# Altium schematic sheet 11 MSM8916_POWER2.SchDoc
size 871 x 579 mm
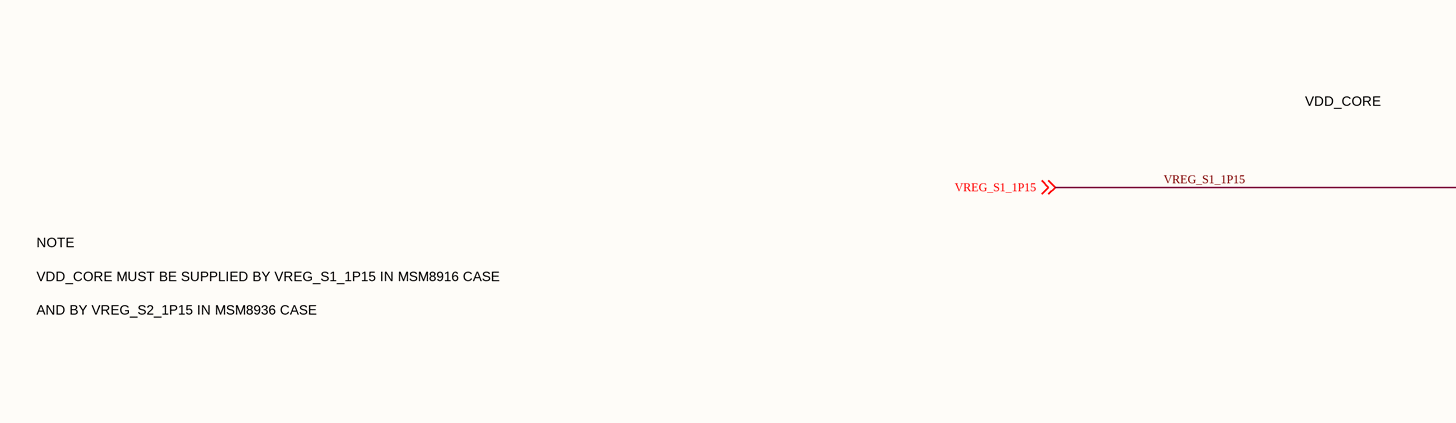
[diagram p0: 11 MSM8916_POWER2.SchDoc, top left]
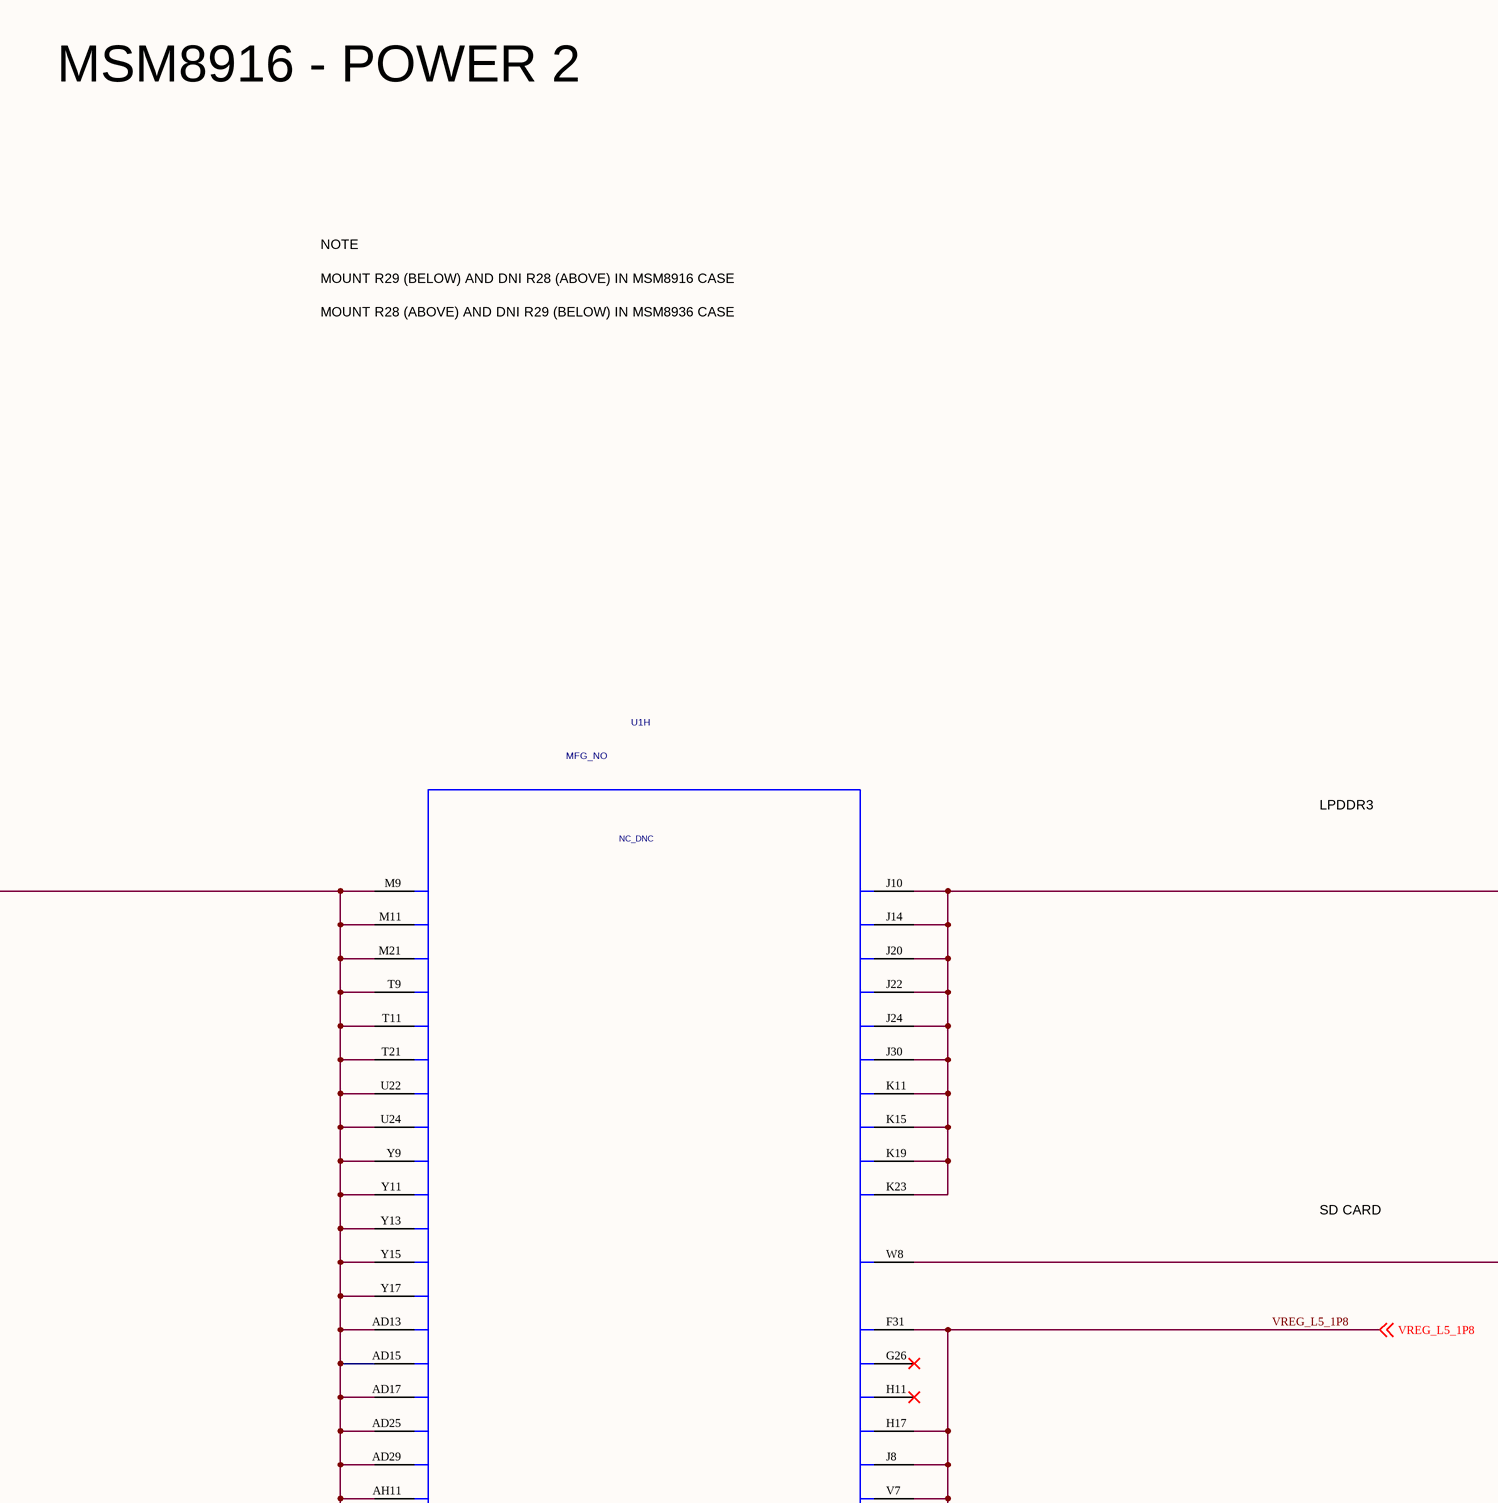
[diagram p1: 11 MSM8916_POWER2.SchDoc, top middle]
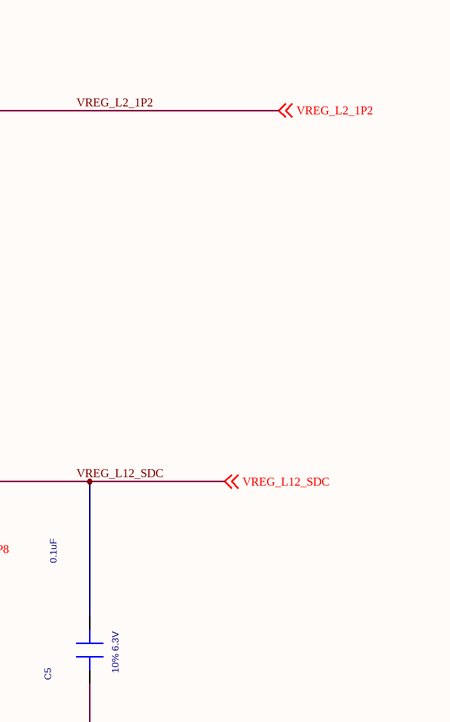
[diagram p2: 11 MSM8916_POWER2.SchDoc, top right]
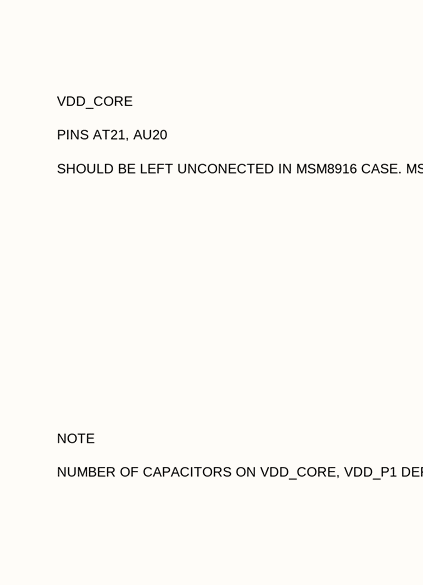
[diagram p3: 11 MSM8916_POWER2.SchDoc, bottom left]
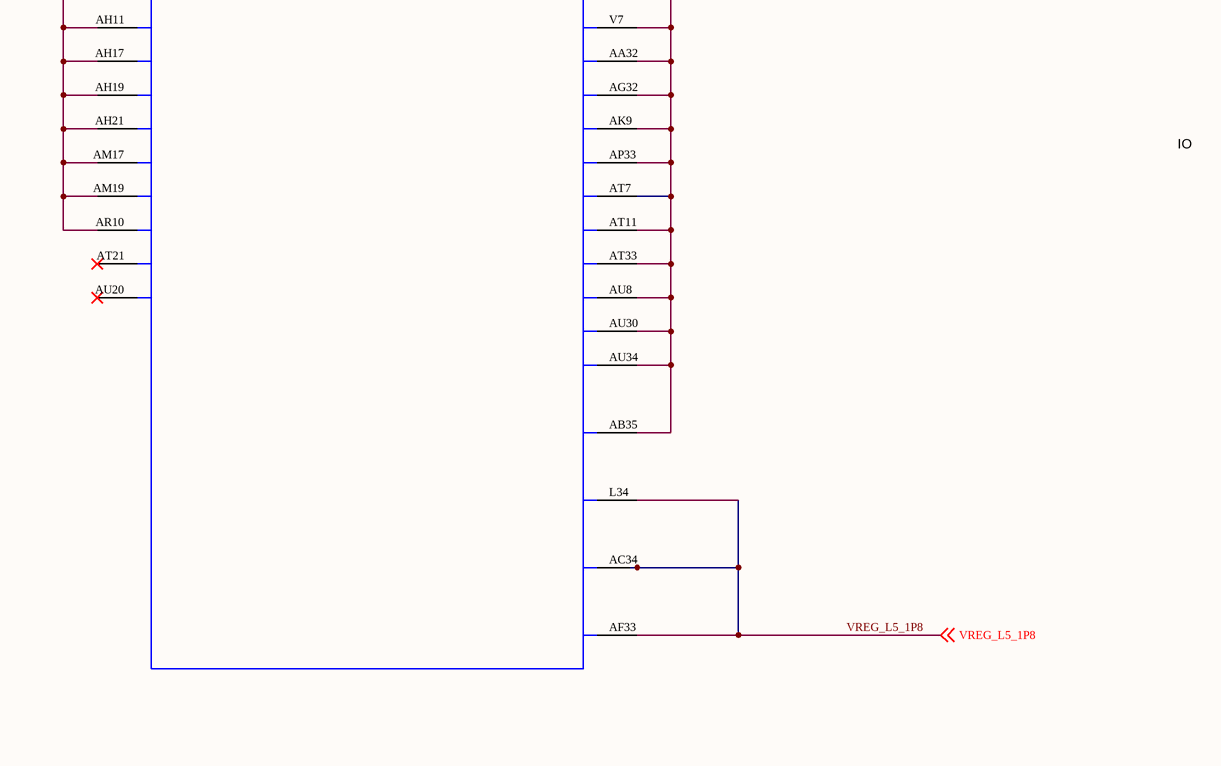
[diagram p4: 11 MSM8916_POWER2.SchDoc, bottom middle]
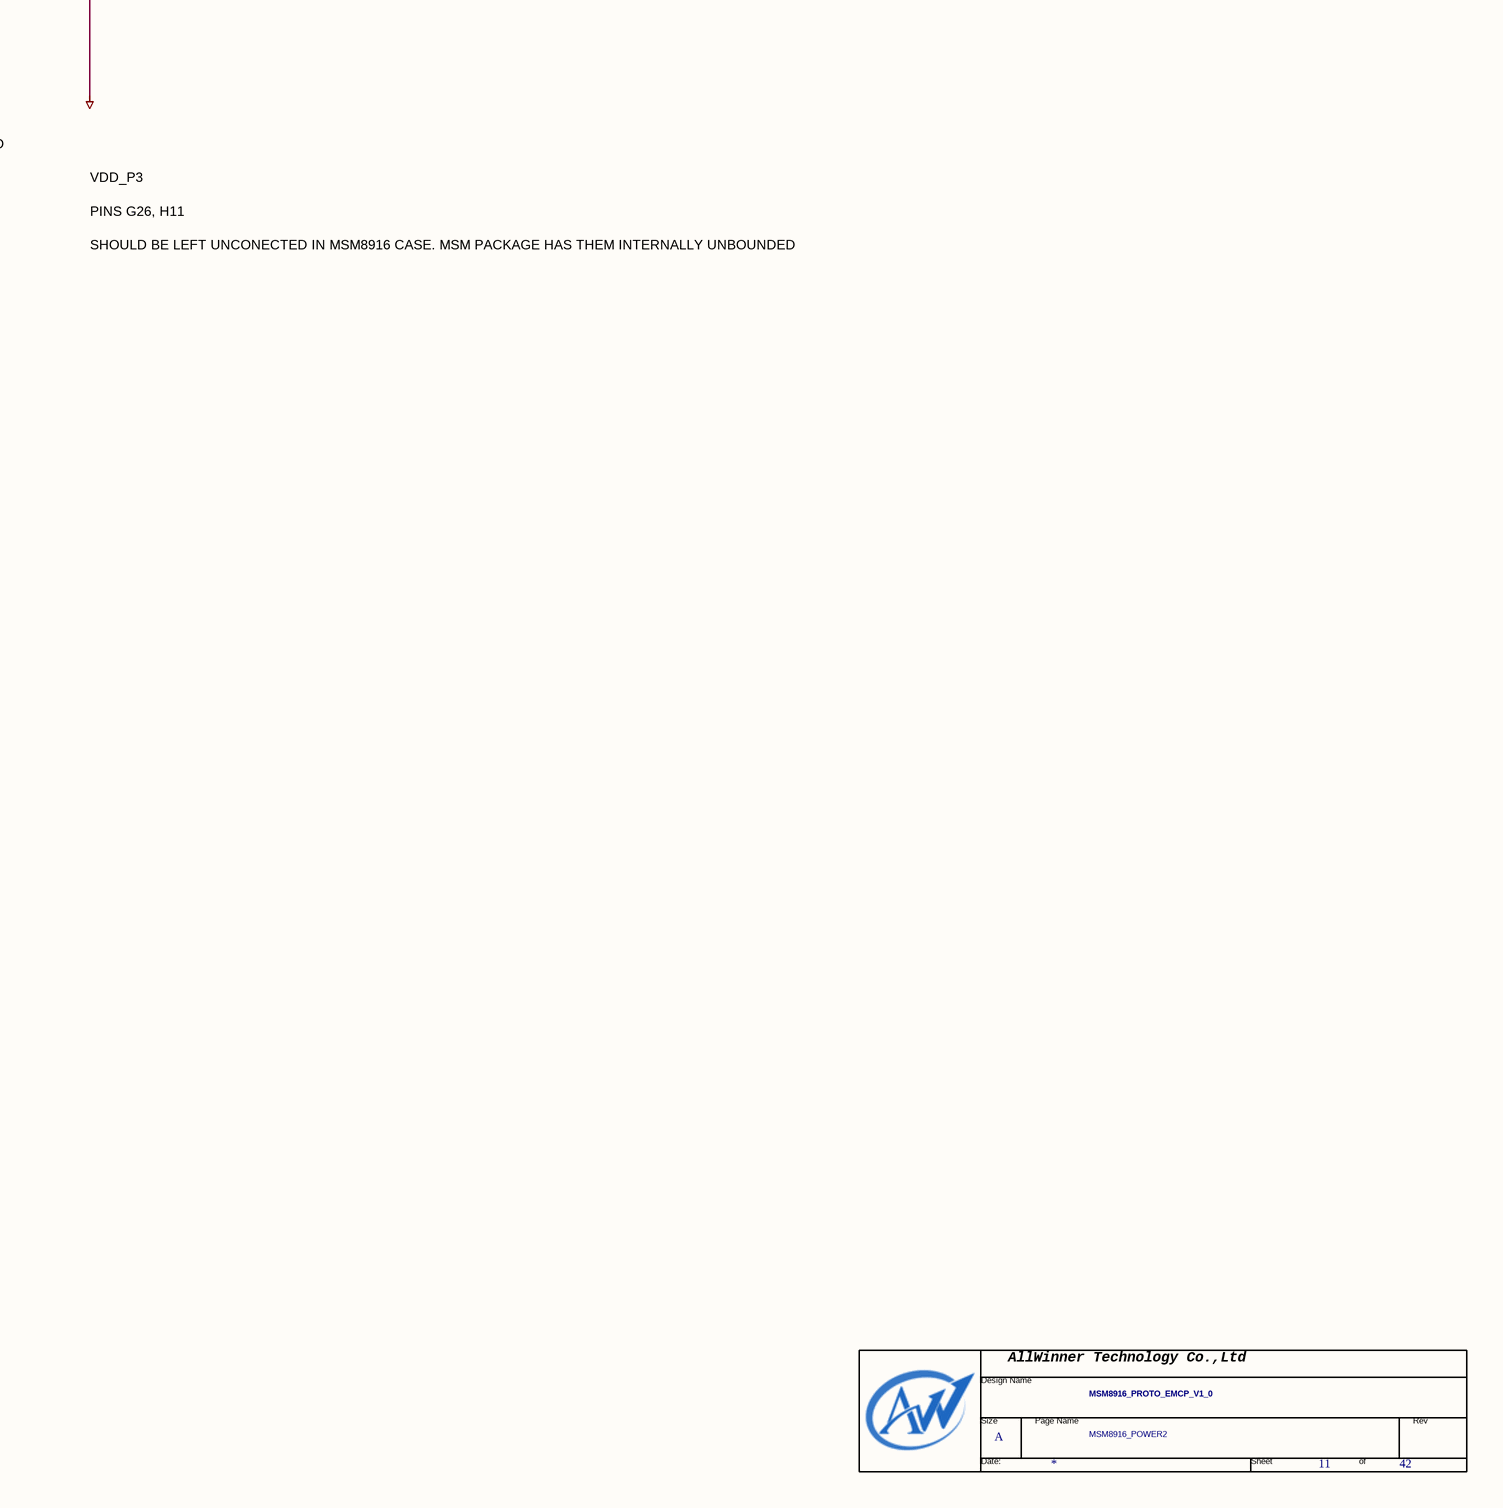
[diagram p5: 11 MSM8916_POWER2.SchDoc, bottom right]

## Parts
*  Page Count: 42  Page Number: 11  Page Size: A  Title: MSM8916_PROTO_EMCP_V1_0  Doc: MSM8916_POWER2  (hidden comment: TitleBlock0-AW)  (graphical)
C5  0.1uF  Tolerance: 10% 6.3V
U1  SYMNAME: NC_DNC  PART_ID: MFG_NO  [MSM-8916-0-760NSP-TR-00-0]  (hidden comment: ASIC_MSM8936_760PIN)  (part H of 13)

## Nets
DGND: C5.1(POS)
VREG_L2_1P2: U1.J10(VDDPX_1_1) U1.J14(VDDPX_1_2) U1.J20(VDDPX_1_3) U1.J22(VDDPX_1_4) U1.J24(VDDPX_1_5) U1.J30(VDDPX_1_6) U1.K11(VDDPX_1_7) U1.K15(VDDPX_1_8) U1.K19(VDDPX_1_9) U1.K23(VDDPX_1_10) ; off-sheet VREG_L2_1P2
VREG_L5_1P8: U1.AA32(VDDPX_3_7) U1.AB35(VDDPX_4) U1.AC34(VDDPX_6) U1.AF33(VDDPX_7) U1.AG32(VDDPX_3_8) U1.AK9(VDDPX_3_9) U1.AP33(VDDPX_3_10) U1.AT7(VDDPX_3_11) U1.AT11(VDDPX_3_12) U1.AT33(VDDPX_3_13) U1.AU8(VDDPX_3_14) U1.AU30(VDDPX_3_15) U1.AU34(VDDPX_3_16) U1.F31(VDDPX_3_1) U1.H17(VDDPX_3_4) U1.J8(VDDPX_3_5) U1.L34(VDDPX_5) U1.V7(VDDPX_3_6) ; off-sheet VREG_L5_1P8
VREG_L12_SDC: C5.2(NEG) U1.W8(VDDPX_2) ; off-sheet VREG_L12_SDC
VREG_S1_1P15: U1.AD13(VDDCX_1_14) U1.AD15(VDDCX_1_15) U1.AD17(VDDCX_1_16) U1.AD25(VDDCX_1_17) U1.AD29(VDDCX_1_18) U1.AH11(VDDCX_1_19) U1.AH17(VDDCX_1_20) U1.AH19(VDDCX_1_21) U1.AH21(VDDCX_1_22) U1.AM17(VDDCX_1_23) U1.AM19(VDDCX_1_24) U1.AR10(VDDCX_1_25) U1.M9(VDDCX_1_1) U1.M11(VDDCX_1_2) U1.M21(VDDCX_1_3) U1.T9(VDDCX_1_4) U1.T11(VDDCX_1_5) U1.T21(VDDCX_1_6) U1.U22(VDDCX_1_7) U1.U24(VDDCX_1_8) U1.Y9(VDDCX_1_9) U1.Y11(VDDCX_1_10) U1.Y13(VDDCX_1_11) U1.Y15(VDDCX_1_12) U1.Y17(VDDCX_1_13) ; off-sheet VREG_S1_1P15

Not connected (* = marked no-connect by the designer): U1 AT21(VDDCX_1_26)* AU20(VDDCX_1_27)* G26(VDDPX_3_2)* H11(VDDPX_3_3)*

## Notes on the sheet
- MSM8916 - POWER 2
- MOUNT R29 (BELOW) AND DNI R28 (ABOVE) IN MSM8916 CASE
- NOTE
- MOUNT R28 (ABOVE) AND DNI R29 (BELOW) IN MSM8936 CASE
- VDD_CORE
- LPDDR3
- VDD_CORE MUST BE SUPPLIED BY VREG_S1_1P15 IN MSM8916 CASE
- AND BY VREG_S2_1P15 IN MSM8936 CASE
- SD CARD
- IO
- PINS G26, H11
- VDD_P3
- PINS AT21, AU20
- SHOULD BE LEFT UNCONECTED IN MSM8916 CASE. MSM PACKAGE HAS THEM INTERNALLY UNBOUNDED
- NUMBER OF CAPACITORS ON VDD_CORE, VDD_P1 DEPENDS ON PDN RESULTS
- (in symbol TitleBlock0-AW) AllWinner Technology Co.,Ltd; Design Name; Size; Page Name; Rev; Date:; Sheet; of

## Library data of the parts
C5 = CAP#1: PART_NUMBER: MCN_NO; PART_ID: MFG_NO; OriginalSymbolOrigin: (-75,50); VOLT: ?V; SYMNAME: CAP; CDS_LMAN_SYM_OUTLINE: -25,50,25,-50; PACK_TYPE: ?
U1 = ASIC_MSM8936_760PIN: PART_NUMBER: MCN_NO; OriginalSymbolOrigin: (-1100,2500); SPLIT_INST: TRUE; CDS_LMAN_SYM_OUTLINE: -1050,2500,1050,-2500; CDS_LMAN_SPLIT_NUMBER: 1 of 13; PACK_TYPE: ?
* = TitleBlock0-AW: RevCode: ?; Page Create Date: March  8, 1995; Page Modify Date: *